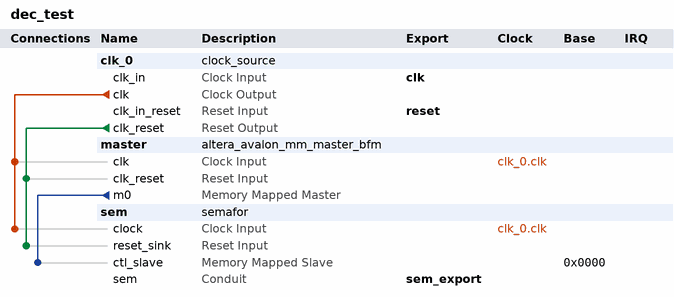
[diagram p0: system contents]
# Platform Designer (Qsys) system dec_test, Cyclone IV E EP4CE115F29C7
# Parameters at their usual value, and those the tool derives, are not listed.
package require -exact qsys 18.1
create_system dec_test
set_project_property DEVICE_FAMILY {Cyclone IV E}
set_project_property DEVICE EP4CE115F29C7

add_instance clk_0 clock_source 18.1
set_instance_parameter_value clk_0 clockFrequency 50000000

add_instance master altera_avalon_mm_master_bfm 18.1
set_instance_parameter_value master ADDRESS_UNITS SYMBOLS
set_instance_parameter_value master AV_ADDRESS_W 32
set_instance_parameter_value master AV_ALWAYS_BURST_MAX_BURST 0
set_instance_parameter_value master AV_BURSTCOUNT_W 3
set_instance_parameter_value master AV_BURST_BNDR_ONLY 1
set_instance_parameter_value master AV_BURST_LINEWRAP 1
set_instance_parameter_value master AV_CONSTANT_BURST_BEHAVIOR 1
set_instance_parameter_value master AV_FIX_READ_LATENCY 1
set_instance_parameter_value master AV_MAX_PENDING_WRITES 0
set_instance_parameter_value master AV_NUMSYMBOLS 4
set_instance_parameter_value master AV_READRESPONSE_W 8
set_instance_parameter_value master AV_READ_WAIT_TIME 1
set_instance_parameter_value master AV_WRITERESPONSE_W 8
set_instance_parameter_value master USE_BURSTCOUNT 0
set_instance_parameter_value master USE_BYTE_ENABLE 1
set_instance_parameter_value master USE_READ 1
set_instance_parameter_value master USE_READ_DATA 1
set_instance_parameter_value master USE_READ_DATA_VALID 1
set_instance_parameter_value master USE_WAIT_REQUEST 1
set_instance_parameter_value master VHDL_ID 0

add_instance sem semafor 1.0
set_instance_parameter_value sem m 8

# connections
add_connection clk_0.clk master.clk clock
add_connection clk_0.clk sem.clock clock
add_connection clk_0.clk_reset master.clk_reset reset
add_connection clk_0.clk_reset sem.reset_sink reset
add_connection master.m0 sem.ctl_slave avalon
set_connection_parameter_value master.m0/sem.ctl_slave baseAddress 0x0000

# exported interfaces
add_interface clk clock sink
set_interface_property clk EXPORT_OF clk_0.clk_in
add_interface reset reset sink
set_interface_property reset EXPORT_OF clk_0.clk_in_reset
add_interface sem_export conduit end
set_interface_property sem_export EXPORT_OF sem.sem

set_interconnect_requirement {$system} qsys_mm.clockCrossingAdapter HANDSHAKE
set_interconnect_requirement {$system} qsys_mm.enableEccProtection FALSE
set_interconnect_requirement {$system} qsys_mm.insertDefaultSlave FALSE
set_interconnect_requirement {$system} qsys_mm.maxAdditionalLatency 1

save_system dec_test.qsys
